# Altium schematic sheet Sheet3.SchDoc: https://github.com/balanceTWK/candy-box
size A4; Author: https://github.com/balanceTWK/candy-box; DrawnBy: https://github.com/balanceTWK/candy-box
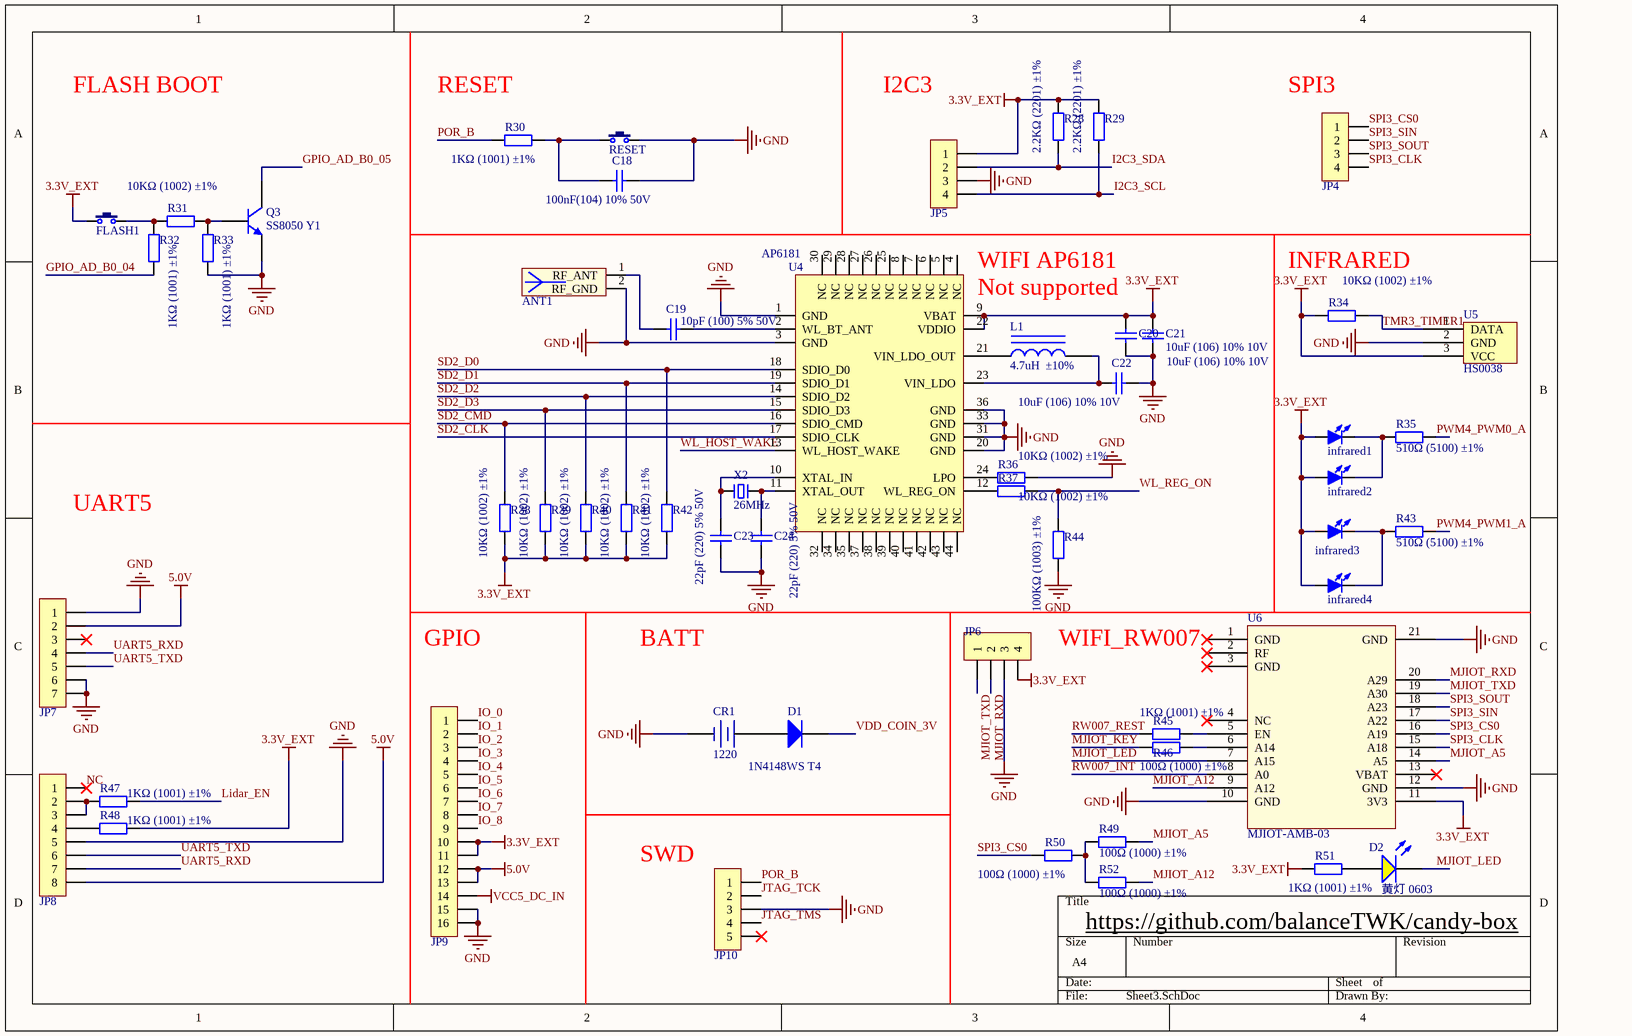
[diagram p0: Sheet3.SchDoc]

## Parts
ANT1  ANT-2.4G  [ANT-2.4G]  (value not drawn)
C18  100nF(104) 10% 50V  [0805_C]
C19  10pF (100) 5% 50V  [0603_C]
C20  10uF (106) 10% 10V  [0603_C]
C21  10uF (106) 10% 10V  [0603_C]
C22  10uF (106) 10% 10V  [0603_C]
C23  22pF (220) 5% 50V  [0603_C]
C24  22pF (220) 5% 50V  [0603_C]
CR1  1220  [CR1220_B]
D1  1N4148WS T4  [SOD-323]
D2  黄灯 0603  [0603_LED_S1]
FLASH1  6x6x5  [TSW DIP-6*6*6_V]  (value not drawn)
infrared1  红色  [LED 3MM-R]  (value not drawn)
infrared2  红色  [LED 3MM-R]  (value not drawn)
infrared3  红色  [LED 3MM-R]  (value not drawn)
infrared4  红色  [LED 3MM-R]  (value not drawn)
JP4  HDR-1X4  [HDR-1X4]  (value not drawn)
JP5  HDR-1X4  [HDR-1X4_M]  (value not drawn)
JP6  HDR-1X4  [HDR-1X4]  (value not drawn)
JP7  HDR-1X7  [HDR-1X7_M]  (value not drawn)
JP8  HDR-1X8  [PH2.0 D-W-8P]  (value not drawn)
JP9  HDR-1X16  [HDR-1X16]  (value not drawn)
JP10  HDR-1X5  [XH2.54-5P]  (value not drawn)
L1  4.7uH  ±10%  [1206_L]
Q3  SS8050 Y1  [SOT-23(SOT-23-3)]
R28  2.2KΩ (2201) ±1%  [0603_R]
R29  2.2KΩ (2201) ±1%  [0603_R]
R30  1KΩ (1001) ±1%  [0603_R]
R31  10KΩ (1002) ±1%  [0603_R]
R32  1KΩ (1001) ±1%  [0603_R]
R33  1KΩ (1001) ±1%  [0603_R]
R34  10KΩ (1002) ±1%  [0603_R]
R35  510Ω (5100) ±1%  [0603_R]
R36  10KΩ (1002) ±1%  [0603_R]
R37  10KΩ (1002) ±1%  [0603_R]
R38  10KΩ (1002) ±1%  [0603_R]
R39  10KΩ (1002) ±1%  [0603_R]
R40  10KΩ (1002) ±1%  [0603_R]
R41  10KΩ (1002) ±1%  [0603_R]
R42  10KΩ (1002) ±1%  [0603_R]
R43  510Ω (5100) ±1%  [0603_R]
R44  100KΩ (1003) ±1%  [0603_R]
R45  1KΩ (1001) ±1%  [0603_R]
R46  100Ω (1000) ±1%  [0603_R]
R47  1KΩ (1001) ±1%  [0603_R]
R48  1KΩ (1001) ±1%  [0603_R]
R49  100Ω (1000) ±1%  [0603_R]
R50  100Ω (1000) ±1%  [0603_R]
R51  1KΩ (1001) ±1%  [0603_R]
R52  100Ω (1000) ±1%  [0603_R]
RESET  6x6x5  [TSW DIP-6*6*6_V]  (value not drawn)
U4  AP6181  [QFN-44]
U5  HS0038  [HS0038]
U6  MJIOT-AMB-03  [20PIN-MODULE-PLATFORM_DEBUG-01]
X2  26MHz  [XTAL-49S DIP]

## Nets
3.3V_EXT: C20.2 C21.2 FLASH1.1 infrared1.1(A) infrared2.1(A) infrared3.1(A) infrared4.1(A) JP5.1 JP6.4 JP9.10 JP9.11 R28.2 R29.2 R34.2 R38.1 R39.1 R40.1 R41.1 R42.1 R48.2 R51.1 U4.9(VBAT) U4.22(VDDIO) U5.3(VCC) U6.11(3V3)
5.0V: JP7.2 JP8.8 JP9.12 JP9.13
GND: ANT1.2(RF_GND) C18.2 C20.1 C21.1 C22.2 C23.2 C24.2 CR1.2(DC-) JP5.3 JP6.3 JP7.1 JP7.6 JP7.7 JP8.5 JP9.15 JP9.16 JP10.3 Q3.2(E) R33.1 R36.1 R44.1 RESET.2 U4.1(GND) U4.3(GND) U4.20(GND) U4.31(GND) U4.33(GND) U4.36(GND) U5.2(GND) U6.10(GND) U6.12(GND) U6.21(GND)
VCC5_DC_IN: JP9.14
GPIO_AD_B0_04: R32.1
GPIO_AD_B0_05: Q3.3(C)
I2C3_SCL: JP5.4 R29.1
I2C3_SDA: JP5.2 R28.1
IO_0: JP9.1
IO_1: JP9.2
IO_2: JP9.3
IO_3: JP9.4
IO_4: JP9.5
IO_5: JP9.6
IO_6: JP9.7
IO_7: JP9.8
IO_8: JP9.9
JTAG_TCK: JP10.2
JTAG_TMS: JP10.4
Lidar_EN: R47.2
MJIOT_A5: R49.2 U6.14(A5)
MJIOT_A12: R52.2 U6.9(A12)
MJIOT_KEY: R46.1
MJIOT_LED: D2.K U6.7(A15)
MJIOT_RXD: JP6.2 U6.20(A29)
MJIOT_TXD: JP6.1 U6.19(A30)
NC: JP8.1
POR_B: JP10.1 R30.2
PWM4_PWM0_A: R35.2
PWM4_PWM1_A: R43.2
RW007_INT: U6.8(A0)
RW007_REST: R45.1
SD2_CLK: U4.17(SDIO_CLK)
SD2_CMD: R38.2 U4.16(SDIO_CMD)
SD2_D0: R42.2 U4.18(SDIO_D0)
SD2_D1: R41.2 U4.19(SDIO_D1)
SD2_D2: R40.2 U4.14(SDIO_D2)
SD2_D3: R39.2 U4.15(SDIO_D3)
SPI3_CLK: JP4.4 U6.15(A18)
SPI3_CS0: JP4.1 R50.1 U6.16(A19)
SPI3_SIN: JP4.2 U6.17(A22)
SPI3_SOUT: JP4.3 U6.18(A23)
TMR3_TIMER1: R34.1 U5.1(DATA)
UART5_RXD: JP7.4 JP8.7
UART5_TXD: JP7.5 JP8.6
VDD_COIN_3V: D1.2(K)
WL_HOST_WAKE: U4.13(WL_HOST_WAKE)
WL_REG_ON: R37.1 R44.2
NetANT1_1: ANT1.1(RF_ANT) C19.1
NetC18_1: C18.1 R30.1 RESET.1
NetC19_2: C19.2 U4.2(WL_BT_ANT)
NetC22_1: C22.1 L1.2 U4.23(VIN_LDO)
NetC23_1: C23.1 U4.10(XTAL_IN) X2.1
NetC24_1: C24.1 U4.11(XTAL_OUT) X2.2
NetCR1_1: CR1.1(DC+) D1.1(A)
NetD2_A: D2.A R51.2
NetFLASH1_2: FLASH1.2 R31.1 R32.2
Netinfrared1_2: infrared1.2(K) infrared2.2(K) R35.1
Netinfrared3_2: infrared3.2(K) infrared4.2(K) R43.1
NetJP8_2: JP8.2 JP8.3 R47.1
NetJP8_4: JP8.4 R48.1
NetL1_1: L1.1 U4.21(VIN_LDO_OUT)
NetQ3_1: Q3.1(B) R31.2 R33.2
NetR36_2: R36.2 U4.24(LPO)
NetR37_2: R37.2 U4.12(WL_REG_ON)
NetR45_2: R45.2 U6.5(EN)
NetR46_2: R46.2 U6.6(A14)
NetR49_1: R49.1 R50.2 R52.1

Not connected (* = marked no-connect by the designer): JP7 3*; JP10 5*; U4 4(NC) 5(NC) 6(NC) 7(NC) 8(NC) 25(NC) 26(NC) 27(NC) 28(NC) 29(NC) 30(NC) 32(NC) 34(NC) 35(NC) 37(NC) 38(NC) 39(NC) 40(NC) 41(NC) 42(NC) 43(NC) 44(NC); U6 1(GND)* 2(RF)* 3(GND)* 4(NC)* 13(VBAT)*

## Notes on the sheet
- FLASH BOOT
- (near R30) RESET
- I2C3
- (near JP4) SPI3
- (near U4) WIFI AP6181
- (near U4) Not supported
- (near R34) INFRARED
- UART5
- GPIO
- BATT
- (near JP6) WIFI_RW007
- SWD
- https://github.com/balanceTWK/candy-box

## Library data of the parts
ANT1 = ANT-2.4G: ANT,2.4G,PCB天线
C18 = 0805 100nF(104) 10% 50V: 贴片电容; ComponentLink1Description: 供应商链接; ComponentLink1URL: http://www.szlcsc.com/product/details_50686.html; Package: 0805; Supplier: LC; SuppliersPartNumber: C49678
C19 = 0603 10pF (100) 5% 50V: 贴片电容; ComponentLink1Description: 供应商链接; ComponentLink1URL: http://www.szlcsc.com/product/details_1986.html; Package: 0603; Supplier: LC; SuppliersPartNumber: C1634
C20-C22 = 0603 10uF (106) 10% 10V: 贴片电容; ComponentLink1Description: 供应商链接; ComponentLink1URL: http://www.szlcsc.com/product/details_20411.html; Package: 0603; Supplier: LC; SuppliersPartNumber: C19702
C23 C24 = 0603 22pF (220) 5% 50V: 贴片电容; ComponentLink1Description: 供应商链接; ComponentLink1URL: http://www.szlcsc.com/product/details_2005.html; Package: 0603; Supplier: LC; SuppliersPartNumber: C1653
CR1 = CR-3V: 微型电池; 版权归属: 源创客; BOM名称: 微型电池; 学习资源: www.ooocke.com
D1 = SOD-323 1N4148WS T4: 二极管; ComponentLink1Description: 供应商链接; ComponentLink1URL: http://www.szlcsc.com/product/details_2485.html; Package: SOD-323; Supplier: LC; SuppliersPartNumber: C2128
D2 = 0603 黄灯: 发光二极管; ComponentLink1Description: 供应商链接; ComponentLink1URL: http://www.szlcsc.com/product/details_73147.html; Package: 0603; Supplier: LC; SuppliersPartNumber: C72038
FLASH1 RESET = TSW DIP-6x6_V: 侧按直插6x6轻触开关; 版权归属: 源创客; BOM名称: 直插6x6轻触开关; 学习资源: www.ooocke.com
infrared1-infrared4 = LED-3MM: 插件LED; 版权归属: 源创客; BOM名称: 插件LED; 学习资源: www.ooocke.com
JP4-JP6 = Header 4: 4P接插件; 版权归属: 源创客; BOM名称: 4P接插件; 学习资源: www.ooocke.com
JP7 = Header 7: 7P接插件; 版权归属: 源创客; BOM名称: 7P接插件; 学习资源: www.ooocke.com
JP8 = Header 8: 8P接插件; 版权归属: 源创客; BOM名称: 8P接插件; 学习资源: www.ooocke.com
JP9 = Header 16: 16P接插件; 版权归属: 源创客; BOM名称: 16P接插件; 学习资源: www.ooocke.com
JP10 = Header 5: 5P接插件; 版权归属: 源创客; BOM名称: 5P接插件; 学习资源: www.ooocke.com
L1 = 1206 4.7uH  10%: 贴片电感; ComponentLink1Description: 供应商链接; ComponentLink1URL: http://www.szlcsc.com/product/details_1401.html; Package: 1206; Supplier: LC; SuppliersPartNumber: C1049
Q3 = SOT-23 SS8050 Y1: 三极管; ComponentLink1Description: 供应商链接; ComponentLink1URL: http://www.szlcsc.com/product/details_2507.html; Package: SOT-23; Supplier: LC; SuppliersPartNumber: C2150
R28 R29 = 0603 2.2KΩ (2201) 1%: 贴片电阻; ComponentLink1Description: 供应商链接; ComponentLink1URL: http://www.szlcsc.com/product/details_4597.html; Package: 0603; Supplier: LC; SuppliersPartNumber: C4190
R30 R32 R33 R45 R47 R48 R51 = 0603 1KΩ (1001) 1%: 贴片电阻; ComponentLink1Description: 供应商链接; ComponentLink1URL: http://www.szlcsc.com/product/details_21904.html; Package: 0603; Supplier: LC; SuppliersPartNumber: C21190
R31 R34 R36-R42 = 0603 10KΩ (1002) 1%: 贴片电阻; ComponentLink1Description: 供应商链接; ComponentLink1URL: http://www.szlcsc.com/product/details_26547.html; Package: 0603; Supplier: LC; SuppliersPartNumber: C25804
R35 R43 = 0603 510Ω (5100) 1%: 贴片电阻; ComponentLink1Description: 供应商链接; ComponentLink1URL: http://www.szlcsc.com/product/details_23920.html; Package: 0603; Supplier: LC; SuppliersPartNumber: C23193
R44 = 0603 100KΩ (1003) 1%: 贴片电阻; ComponentLink1Description: 供应商链接; ComponentLink1URL: http://www.szlcsc.com/product/details_26546.html; Package: 0603; Supplier: LC; SuppliersPartNumber: C25803
R46 R49 R50 R52 = 0603 100Ω (1000) 1%: 贴片电阻; ComponentLink1Description: 供应商链接; ComponentLink1URL: http://www.szlcsc.com/product/details_23502.html; Package: 0603; Supplier: LC; SuppliersPartNumber: C22775
U4 = U-AP6181: WIFI Module,SDIO
X2 = XTAL-2: 2脚晶振; 版权归属: 源创客; BOM名称: 2脚晶振; 学习资源: www.ooocke.com